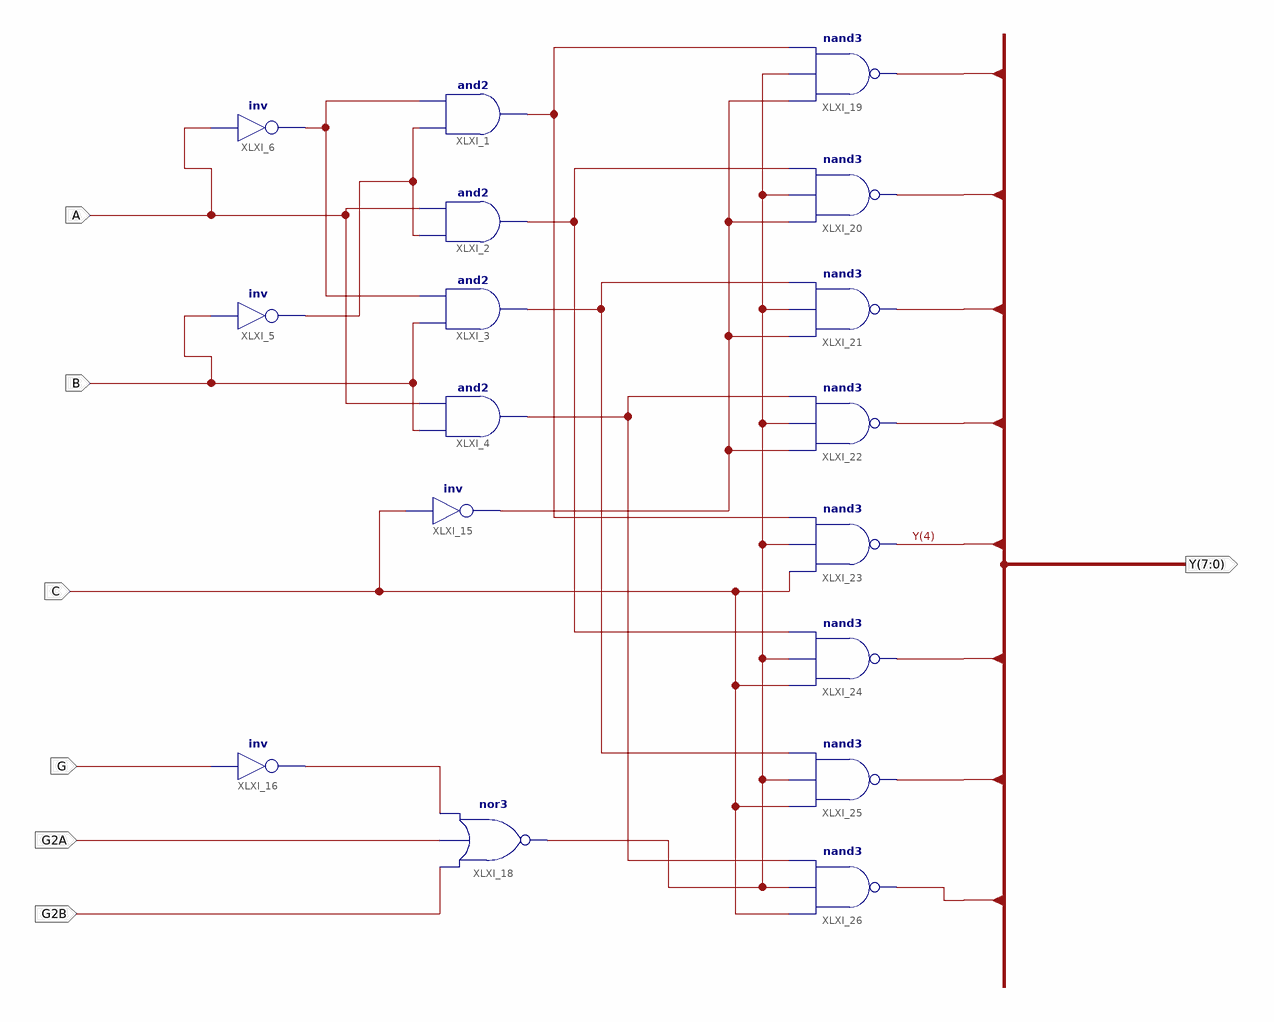
[diagram p0: schematic sheet 1]
// Xilinx ISE schematic D_74LS138.sch (kintex7) as structural Verilog: 17 symbols, 7 ports
module D_74LS138 (
  input  C,
  input  G,
  input  G2A,
  input  G2B,
  input  A,
  input  B,
  output [7:0] Y
);

  wire XLXN_18, XLXN_27, XLXN_31, XLXN_32, XLXN_33, XLXN_34, XLXN_35, XLXN_45, XLXN_51;

  and XLXI_1 (XLXN_32, XLXN_51, XLXN_45);
  and XLXI_2 (XLXN_31, XLXN_51, A);
  and XLXI_3 (XLXN_33, B, XLXN_45);
  and XLXI_4 (XLXN_34, B, A);
  not XLXI_5 (XLXN_51, B);
  not XLXI_6 (XLXN_45, A);
  not XLXI_15 (XLXN_35, C);
  not XLXI_16 (XLXN_18, G);
  nor XLXI_18 (XLXN_27, G2B, G2A, XLXN_18);
  nand XLXI_19 (Y[0], XLXN_35, XLXN_27, XLXN_32);
  nand XLXI_20 (Y[1], XLXN_35, XLXN_27, XLXN_31);
  nand XLXI_21 (Y[2], XLXN_35, XLXN_27, XLXN_33);
  nand XLXI_22 (Y[3], XLXN_35, XLXN_27, XLXN_34);
  nand XLXI_23 (Y[4], C, XLXN_27, XLXN_32);
  nand XLXI_24 (Y[5], C, XLXN_27, XLXN_31);
  nand XLXI_25 (Y[6], C, XLXN_27, XLXN_33);
  nand XLXI_26 (Y[7], C, XLXN_27, XLXN_34);
endmodule
